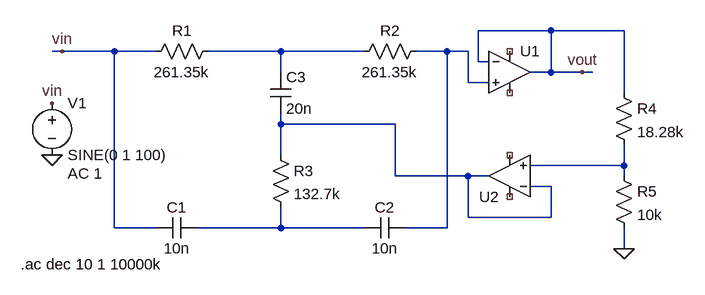
[diagram p0: schematic twin_t_noth_60_feq_analysis.asc]
twin_t_noth_60_feq_analysis.asc, the LTspice schematic file:
Version 4
SHEET 1 880 680
WIRE 480 64 368 64
WIRE 592 64 480 64
WIRE -272 96 -288 96
WIRE -192 96 -272 96
WIRE -128 96 -192 96
WIRE 64 96 -48 96
WIRE 192 96 64 96
WIRE 320 96 272 96
WIRE 352 96 320 96
WIRE 368 112 368 64
WIRE 384 112 368 112
WIRE 64 128 64 96
WIRE 480 128 480 64
WIRE 480 128 448 128
WIRE 528 128 480 128
WIRE 544 128 528 128
WIRE 352 144 352 96
WIRE 384 144 352 144
WIRE 592 160 592 64
WIRE 64 208 64 192
WIRE 240 208 64 208
WIRE 64 256 64 208
WIRE 592 272 592 240
WIRE 592 272 448 272
WIRE 240 288 240 208
WIRE 352 288 240 288
WIRE 384 288 352 288
WIRE 592 288 592 272
WIRE 480 304 448 304
WIRE 352 352 352 288
WIRE 480 352 480 304
WIRE 480 352 352 352
WIRE -192 368 -192 96
WIRE -128 368 -192 368
WIRE 64 368 64 336
WIRE 64 368 -64 368
WIRE 192 368 64 368
WIRE 320 368 320 96
WIRE 320 368 256 368
WIRE 592 400 592 368
FLAG 592 400 0
FLAG 528 128 vout
FLAG -288 256 0
FLAG -288 176 vin
FLAG -272 96 vin
SYMBOL res -144 112 R270
WINDOW 0 32 56 VTop 2
WINDOW 3 0 56 VBottom 2
SYMATTR InstName R1
SYMATTR Value 261.35k
SYMBOL res 176 112 R270
WINDOW 0 32 56 VTop 2
WINDOW 3 0 56 VBottom 2
SYMATTR InstName R2
SYMATTR Value 261.35k
SYMBOL cap -64 352 R90
WINDOW 0 0 32 VBottom 2
WINDOW 3 32 32 VTop 2
SYMATTR InstName C1
SYMATTR Value 10n
SYMBOL cap 256 352 R90
WINDOW 0 0 32 VBottom 2
WINDOW 3 32 32 VTop 2
SYMATTR InstName C2
SYMATTR Value 10n
SYMBOL cap 48 128 R0
SYMATTR InstName C3
SYMATTR Value 20n
SYMBOL res 48 240 R0
SYMATTR InstName R3
SYMATTR Value 132.7k
SYMBOL OpAmps\\UniversalOpAmp 416 128 R0
SYMATTR InstName U1
SYMBOL OpAmps\\UniversalOpAmp 416 288 R180
SYMATTR InstName U2
SYMBOL res 576 144 R0
SYMATTR InstName R4
SYMATTR Value 18.28k
SYMBOL res 576 272 R0
SYMATTR InstName R5
SYMATTR Value 10k
SYMBOL voltage -288 160 R0
WINDOW 123 24 124 Left 2
WINDOW 39 0 0 Left 0
SYMATTR InstName V1
SYMATTR Value SINE(0 1 100)
SYMATTR Value2 AC 1
TEXT -336 424 Left 2 !.ac dec 10 1 10000k

The netlist it stands for:
* twin_t_noth_60_feq_analysis.asc
R1 vin N001 261.35k
R2 N001 N002 261.35k
C1 N005 vin 10n
C2 N002 N005 10n
C3 N001 N003 20n
R3 N003 N005 132.7k
XU1 N002 vout NC_01 NC_02 vout level1 Avol=1Meg GBW=10Meg Vos=0 En=0 Enk=0 In=0 Ink=0 Rin=500Meg  ; pins In+ In- V+ V- OUT
XU2 N004 N003 NC_03 NC_04 N003 level1 Avol=1Meg GBW=10Meg Vos=0 En=0 Enk=0 In=0 Ink=0 Rin=500Meg  ; pins In+ In- V+ V- OUT
R4 vout N004 18.28k
R5 N004 0 10k
V1 vin 0 SINE(0 1 100) AC 1
.ac dec 10 1 10000k
.lib UniversalOpAmp1.lib
.backanno
.end